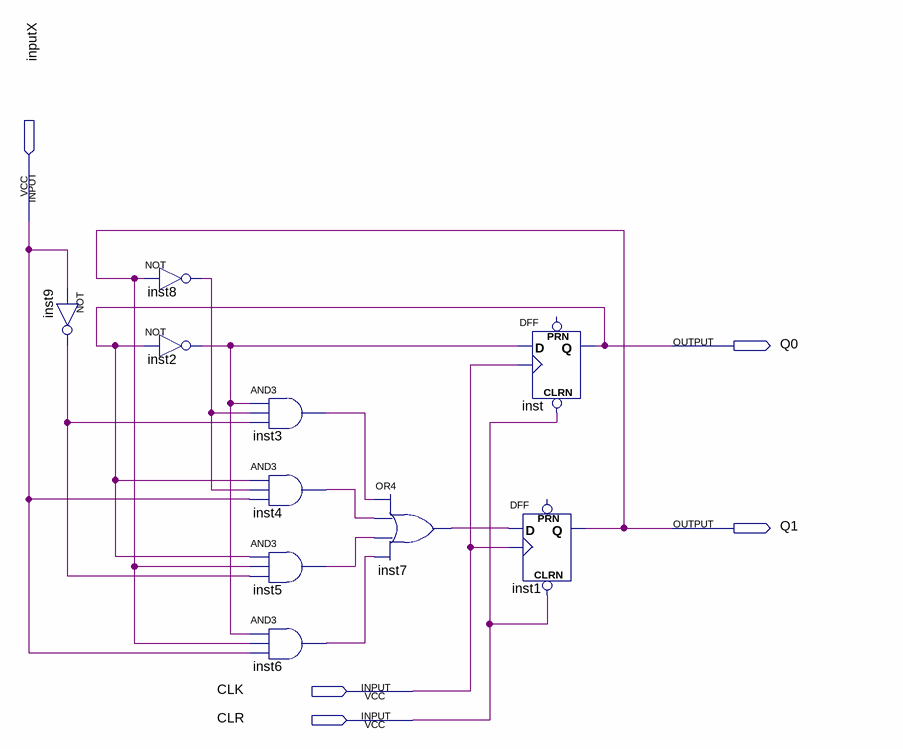
[diagram p0: schematic sheet]
// Quartus schematic MEF.bdf as structural Verilog: 10 symbols, 5 pins
module MEF (
  input  inputX,
  input  CLK,
  input  CLR,
  output Q0,
  output Q1
);

  wire inst2_out, inst3_out, inst4_out, inst5_out, inst6_out, inst7_out, inst8_out, inst9_out;

  not inst9 (inst9_out, inputX);
  not inst8 (inst8_out, Q1);
  not inst2 (inst2_out, Q0);
  and inst3 (inst3_out, inst2_out, inst8_out, inst9_out);
  and inst4 (inst4_out, Q0, inst8_out, inputX);
  and inst5 (inst5_out, Q0, Q1, inst9_out);
  and inst6 (inst6_out, inst2_out, Q1, inputX);
  or inst7 (inst7_out, inst3_out, inst4_out, inst5_out, inst6_out);
  DFF inst (.CLRN(CLR), .CLK(CLK), .D(inst2_out), .Q(Q0));  // open: PRN
  DFF inst1 (.CLRN(CLR), .CLK(CLK), .D(inst7_out), .Q(Q1));  // open: PRN
endmodule
